# Altium schematic sheet uSD.SchDoc
size A4; SheetNumber: 7; SheetTotal: 8
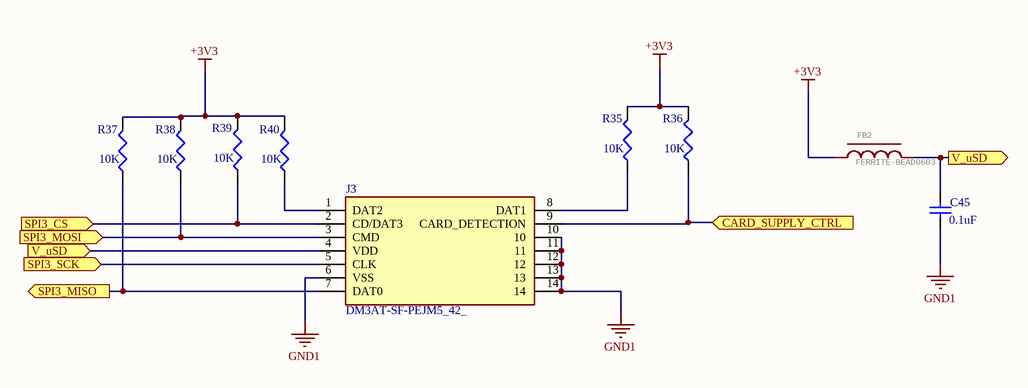
[diagram p0: uSD.SchDoc]

## Parts
C45  value 0.1uF  [1608[0603]]  (hidden comment: Cap Semi)
FB2  FERRITE-BEAD0603  [0603_INCH]
J3  DM3AT-SF-PEJM5_42_  [DM3ATSFPEJM542]
R35  value 10K  [J1-0603]  (hidden comment: Res3)
R36  value 10K  [J1-0603]  (hidden comment: Res3)
R37  value 10K  [J1-0603]  (hidden comment: Res3)
R38  value 10K  [J1-0603]  (hidden comment: Res3)
R39  value 10K  [J1-0603]  (hidden comment: Res3)
R40  value 10K  [J1-0603]  (hidden comment: Res3)

## Ports
CARD_SUPPLY_CTRL (in), SPI3_CS (in), SPI3_MISO (out), SPI3_MOSI (in), SPI3_SCK (in), V_uSD (in), V_uSD (out)

## Nets
+3V3: FB2.1 R35.2 R36.2 R37.2 R38.2 R39.2 R40.2
GND1: C45.1 J3.6(VSS) J3.10 J3.11 J3.12 J3.13 J3.14
CARD_SUPPLY_CTRL: J3.9(CARD_DETECTION) R36.1 ; port CARD_SUPPLY_CTRL
SPI3_CS: J3.2(CD/DAT3) R39.1 ; port SPI3_CS
SPI3_MISO: J3.7(DAT0) R37.1 ; port SPI3_MISO
SPI3_MOSI: J3.3(CMD) R38.1 ; port SPI3_MOSI
SPI3_SCK: J3.5(CLK) ; port SPI3_SCK
V_uSD: C45.2 FB2.2 J3.4(VDD) ; port V_uSD
NetJ3_1: J3.1(DAT2) R40.1
NetJ3_8: J3.8(DAT1) R35.1

## Library data of the parts
C45 = Cap Semi: Capacitor (Semiconductor SIM Model); Published: 8-Jun-2000; LatestRevisionDate: 29-May-2009; LatestRevisionNote: IPC-7351 Footprint Added.; PackageReference: C1206; Publisher: Altium Limited; PackageDescription: Chip Capacitor
FB2 = FERRITE-BEAD0603: GateName_1: G$1; SymbolName_1: FBEAD; DeviceName: 0603; LibraryName: COMPAQ; DeviceSetName: FERRITE-BEAD; Package: 0603_INCH
J3 = DM3AT-SF-PEJM5_42_: Connector; Manufacturer_Name: Hirose; Manufacturer_Part_Number: DM3AT-SF-PEJM5(42); Datasheet Link: https://www.hirose.com/product/document?clcode=CL0609-0031-0-00&productname=DM3AT-SF-PEJM5&series=DM3&documenttype=2DDrawing&lang=en&documentid=0000947170; Height: 1.83mm; Mouser Part Number: 798-DM3AT-SF-PEJM542; Mouser Price/Stock: https://www.mouser.co.uk/ProductDetail/Hirose-Connector/DM3AT-SF-PEJM542?qs=%252BAZVS4b%2FkgKS6d9u59mSuA%3D%3D
R35-R40 = Res3: Resistor; Published: 8-Jun-2000; LatestRevisionDate: 29-May-2009; LatestRevisionNote: IPC-7351 Footprint Added.; PackageReference: J1-0603; Publisher: Altium Limited; PackageDescription: Chip Resistor